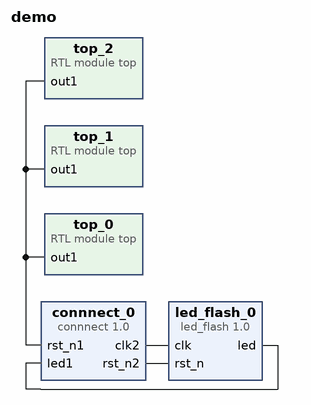
[diagram p0: block diagram of the top level]
# Vivado block design demo, xc7z010clg400-1, Vivado 2022.2
create_bd_design demo

create_bd_cell -type ip -vlnv xilinx.com:user:led_flash:1.0 led_flash_0
create_bd_cell -type ip -vlnv xilinx.com:user:connnect:1.0 connnect_0
create_bd_cell -type module -reference top top_0
create_bd_cell -type module -reference top top_1
create_bd_cell -type module -reference top top_2

# ---- connections ----

connect_bd_net [get_bd_pins top_0/out1] [get_bd_pins connnect_0/rst_n1] [get_bd_pins top_1/out1] [get_bd_pins top_2/out1]
connect_bd_net [get_bd_pins connnect_0/clk2] [get_bd_pins led_flash_0/clk]
connect_bd_net [get_bd_pins connnect_0/rst_n2] [get_bd_pins led_flash_0/rst_n]
connect_bd_net [get_bd_pins led_flash_0/led] [get_bd_pins connnect_0/led1]

validate_bd_design
save_bd_design
